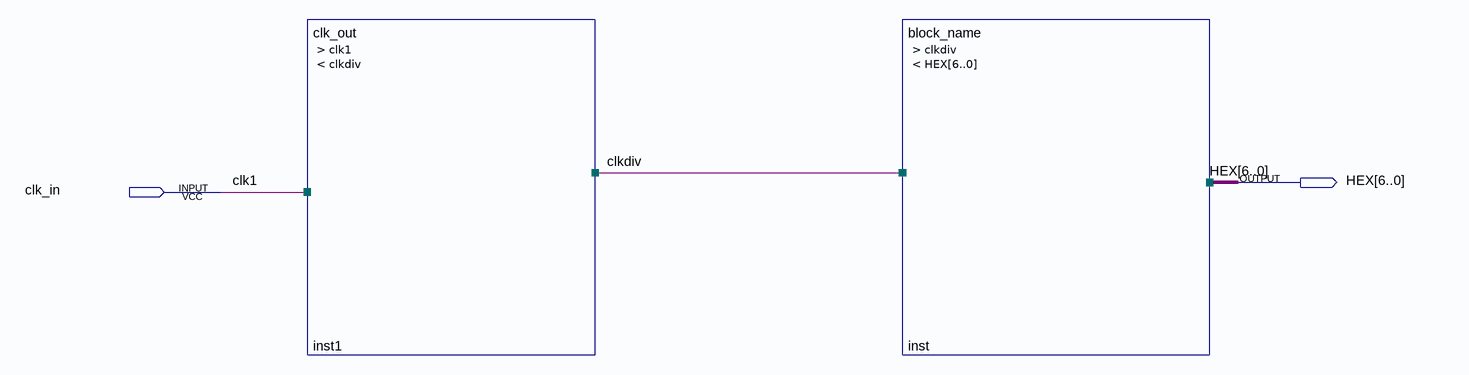
[diagram p0: schematic sheet]
// Quartus schematic wysw.bdf as structural Verilog: 2 symbols, 2 pins
module wysw (
  input  clk_in,
  output [6:0] HEX
);

  wire clkdiv;

  clk_out inst1 (.clk1(clk_in), .clkdiv(clkdiv));
  block_name inst (.clkdiv(clkdiv), .HEX(HEX));

  // Other names for the same wires on the sheet: clk1 = clk_in
endmodule
